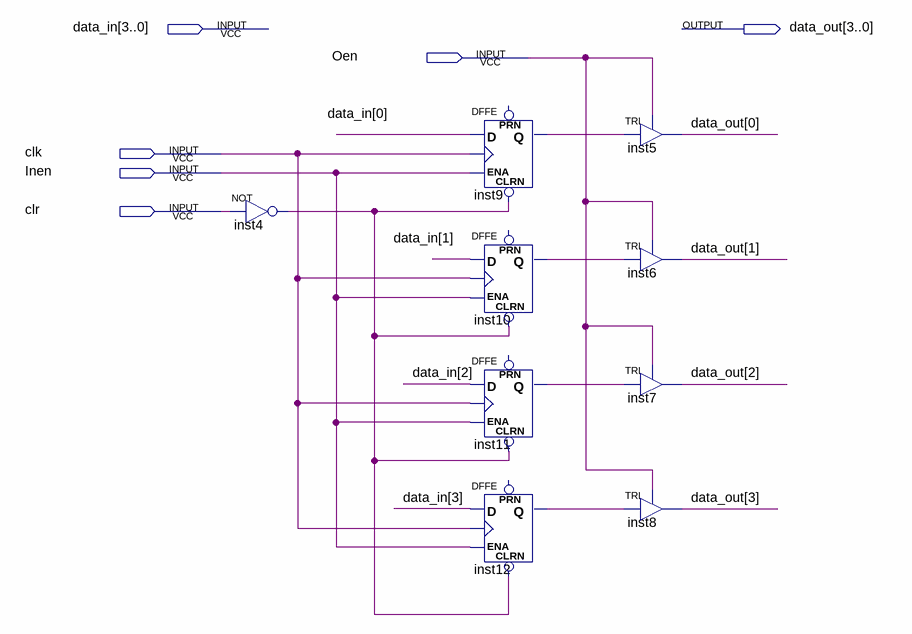
[diagram p0: schematic sheet]
// Quartus schematic InenOen4bit.bdf as structural Verilog: 9 symbols, 6 pins
module InenOen4bit (
  input  [3:0] data_in,
  input  Oen,
  input  clk,
  input  Inen,
  input  clr,
  output [3:0] data_out
);

  wire inst4_out, inst9_q, inst10_q, inst11_q, inst12_q;

  not inst4 (inst4_out, clr);
  DFFE inst9 (.CLRN(inst4_out), .D(data_in[0]), .CLK(clk), .ENA(Inen), .Q(inst9_q));  // open: PRN
  DFFE inst10 (.CLRN(inst4_out), .D(data_in[1]), .CLK(clk), .ENA(Inen), .Q(inst10_q));  // open: PRN
  DFFE inst11 (.CLRN(inst4_out), .D(data_in[2]), .CLK(clk), .ENA(Inen), .Q(inst11_q));  // open: PRN
  DFFE inst12 (.CLRN(inst4_out), .D(data_in[3]), .CLK(clk), .ENA(Inen), .Q(inst12_q));  // open: PRN
  TRI inst5 (.IN(inst9_q), .OE(Oen), .OUT(data_out[0]));
  TRI inst6 (.IN(inst10_q), .OE(Oen), .OUT(data_out[1]));
  TRI inst7 (.IN(inst11_q), .OE(Oen), .OUT(data_out[2]));
  TRI inst8 (.IN(inst12_q), .OE(Oen), .OUT(data_out[3]));
endmodule
